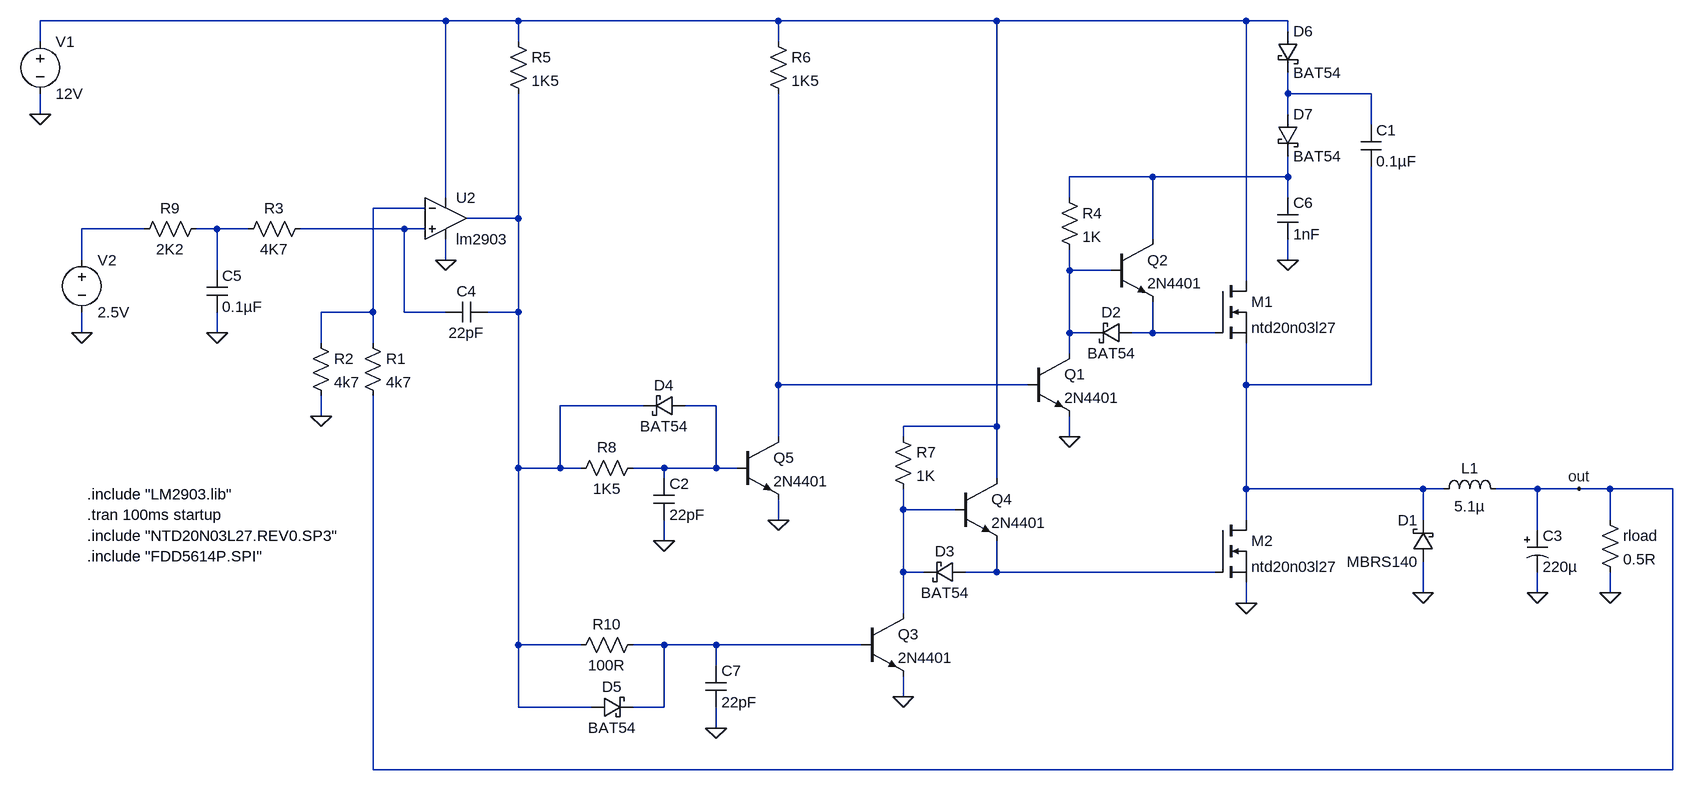
[diagram p0: schematic discrete buck - 10A.asc]
discrete buck - 10A.asc, the LTspice schematic file:
Version 4
SHEET 1 1956 1540
WIRE -288 96 -912 96
WIRE -176 96 -288 96
WIRE 224 96 -176 96
WIRE 560 96 224 96
WIRE 944 96 560 96
WIRE 1008 96 944 96
WIRE 1008 112 1008 96
WIRE -912 128 -912 96
WIRE -176 128 -176 96
WIRE 224 128 224 96
WIRE 1008 208 1008 176
WIRE 1136 208 1008 208
WIRE -912 240 -912 208
WIRE 1008 240 1008 208
WIRE 1136 256 1136 208
WIRE 800 336 672 336
WIRE 1008 336 1008 304
WIRE 1008 336 800 336
WIRE -288 368 -288 96
WIRE 672 368 672 336
WIRE 1008 368 1008 336
WIRE -320 384 -400 384
WIRE -176 400 -176 208
WIRE -176 400 -256 400
WIRE -752 416 -848 416
WIRE -640 416 -672 416
WIRE -592 416 -640 416
WIRE -352 416 -512 416
WIRE -320 416 -352 416
WIRE 800 432 800 336
WIRE -848 464 -848 416
WIRE -288 464 -288 432
WIRE 1008 464 1008 432
WIRE -640 480 -640 416
WIRE 672 480 672 448
WIRE 736 480 672 480
WIRE 944 496 944 96
WIRE -400 544 -400 384
WIRE -400 544 -480 544
WIRE -352 544 -352 416
WIRE -288 544 -352 544
WIRE -176 544 -176 400
WIRE -176 544 -224 544
WIRE -848 576 -848 544
WIRE -640 576 -640 544
WIRE 672 576 672 480
WIRE 704 576 672 576
WIRE 800 576 800 528
WIRE 800 576 768 576
WIRE 896 576 800 576
WIRE -480 592 -480 544
WIRE -400 592 -400 544
WIRE 672 608 672 576
WIRE 224 656 224 208
WIRE 608 656 224 656
WIRE 944 656 944 592
WIRE 1136 656 1136 320
WIRE 1136 656 944 656
WIRE 16 688 -112 688
WIRE 128 688 80 688
WIRE -480 704 -480 672
WIRE 560 720 560 96
WIRE 560 720 416 720
WIRE 224 736 224 656
WIRE 416 736 416 720
WIRE 672 736 672 704
WIRE -176 784 -176 544
WIRE -112 784 -112 688
WIRE -112 784 -176 784
WIRE -80 784 -112 784
WIRE 48 784 0 784
WIRE 128 784 128 688
WIRE 128 784 48 784
WIRE 160 784 128 784
WIRE 48 800 48 784
WIRE 560 800 560 720
WIRE 944 816 944 656
WIRE 1216 816 944 816
WIRE 1248 816 1216 816
WIRE 1392 816 1328 816
WIRE 1456 816 1392 816
WIRE 1504 816 1456 816
WIRE 1600 816 1504 816
WIRE 416 848 416 816
WIRE 496 848 416 848
WIRE 224 864 224 832
WIRE 944 864 944 816
WIRE 1216 864 1216 816
WIRE 1504 864 1504 816
WIRE 1392 880 1392 816
WIRE 48 896 48 864
WIRE 416 944 416 848
WIRE 448 944 416 944
WIRE 560 944 560 896
WIRE 560 944 512 944
WIRE 896 944 560 944
WIRE 1216 976 1216 928
WIRE 1392 976 1392 944
WIRE 1504 976 1504 944
WIRE 944 992 944 960
WIRE 416 1008 416 944
WIRE -176 1056 -176 784
WIRE -80 1056 -176 1056
WIRE 48 1056 0 1056
WIRE 128 1056 48 1056
WIRE 352 1056 128 1056
WIRE 128 1088 128 1056
WIRE 416 1136 416 1104
WIRE -176 1152 -176 1056
WIRE -64 1152 -176 1152
WIRE 48 1152 48 1056
WIRE 48 1152 0 1152
WIRE 128 1184 128 1152
WIRE -400 1248 -400 672
WIRE 1600 1248 1600 816
WIRE 1600 1248 -400 1248
FLAG -912 240 0
FLAG -288 464 0
FLAG 1392 976 0
FLAG 1504 976 0
FLAG -640 576 0
FLAG 1216 976 0
FLAG 1456 816 out
FLAG -848 576 0
FLAG -480 704 0
FLAG 944 992 0
FLAG 416 1136 0
FLAG 672 736 0
FLAG 48 896 0
FLAG 1008 464 0
FLAG 224 864 0
FLAG 128 1184 0
SYMBOL voltage -912 112 R0
WINDOW 123 0 0 Left 2
WINDOW 39 0 0 Left 2
SYMATTR InstName V1
SYMATTR Value 12V
SYMBOL Opamps\\opamp2 -288 336 R0
SYMATTR InstName U2
SYMATTR Value lm2903
SYMBOL schottky 1232 928 R180
WINDOW 0 24 64 Left 2
WINDOW 3 24 0 Left 2
SYMATTR InstName D1
SYMATTR Value MBRS140
SYMATTR Description Diode
SYMATTR Type diode
SYMBOL polcap 1376 880 R0
WINDOW 3 24 56 Left 2
SYMATTR Value 220µ
SYMATTR InstName C3
SYMATTR Description Capacitor
SYMATTR Type cap
SYMATTR SpiceLine V=10 Irms=1.535 Rser=0.07 Lser=0 mfg="KEMET" pn="T495X227K010AS4823" type="Tantalum"
SYMBOL ind 1232 832 R270
WINDOW 0 32 56 VTop 2
WINDOW 3 5 56 VBottom 2
SYMATTR InstName L1
SYMATTR Value 5.1µ
SYMATTR SpiceLine Ipk=11.2 Rser=0.0057 Rpar=1000k Cpar=0
SYMBOL schottky 768 560 R90
WINDOW 0 0 32 VBottom 2
WINDOW 3 32 32 VTop 2
SYMATTR InstName D2
SYMATTR Value BAT54
SYMATTR Description Diode
SYMATTR Type diode
SYMBOL res 656 352 R0
SYMATTR InstName R4
SYMATTR Value 1K
SYMBOL res -192 112 R0
SYMATTR InstName R5
SYMATTR Value 1K5
SYMBOL cap -224 528 R90
WINDOW 0 0 32 VBottom 2
WINDOW 3 32 32 VTop 2
SYMATTR InstName C4
SYMATTR Value 22pF
SYMBOL res -656 400 R90
WINDOW 0 0 56 VBottom 2
WINDOW 3 32 56 VTop 2
SYMATTR InstName R9
SYMATTR Value 2K2
SYMBOL cap -656 480 R0
SYMATTR InstName C5
SYMATTR Value 0.1µF
SYMBOL res 1488 848 R0
SYMATTR InstName rload
SYMATTR Value 0.5R
SYMBOL nmos 896 864 R0
SYMATTR InstName M2
SYMATTR Value ntd20n03l27
SYMATTR Prefix X
SYMBOL voltage -848 448 R0
WINDOW 123 0 0 Left 2
WINDOW 39 0 0 Left 2
SYMATTR InstName V2
SYMATTR Value 2.5V
SYMBOL res -416 576 R0
SYMATTR InstName R1
SYMATTR Value 4k7
SYMBOL res -496 576 R0
SYMATTR InstName R2
SYMATTR Value 4k7
SYMBOL npn3 736 432 R0
SYMATTR InstName Q2
SYMATTR Value 2N4401
SYMBOL res -496 400 R90
WINDOW 0 0 56 VBottom 2
WINDOW 3 32 56 VTop 2
SYMATTR InstName R3
SYMATTR Value 4K7
SYMBOL res 400 720 R0
SYMATTR InstName R7
SYMATTR Value 1K
SYMBOL npn3 496 800 R0
SYMATTR InstName Q4
SYMATTR Value 2N4401
SYMBOL schottky 512 928 R90
WINDOW 0 0 32 VBottom 2
WINDOW 3 32 32 VTop 2
SYMATTR InstName D3
SYMATTR Value BAT54
SYMATTR Description Diode
SYMATTR Type diode
SYMBOL npn3 352 1008 R0
SYMATTR InstName Q3
SYMATTR Value 2N4401
SYMBOL res 16 1040 R90
WINDOW 0 0 56 VBottom 2
WINDOW 3 32 56 VTop 2
SYMATTR InstName R10
SYMATTR Value 100R
SYMBOL npn3 608 608 R0
SYMATTR InstName Q1
SYMATTR Value 2N4401
SYMBOL res 16 768 R90
WINDOW 0 0 56 VBottom 2
WINDOW 3 32 56 VTop 2
SYMATTR InstName R8
SYMATTR Value 1K5
SYMBOL schottky 80 672 R90
WINDOW 0 0 32 VBottom 2
WINDOW 3 32 32 VTop 2
SYMATTR InstName D4
SYMATTR Value BAT54
SYMATTR Description Diode
SYMATTR Type diode
SYMBOL cap 32 800 R0
SYMATTR InstName C2
SYMATTR Value 22pF
SYMBOL schottky -64 1168 R270
WINDOW 0 32 32 VTop 2
WINDOW 3 0 32 VBottom 2
SYMATTR InstName D5
SYMATTR Value BAT54
SYMATTR Description Diode
SYMATTR Type diode
SYMBOL nmos 896 496 R0
SYMATTR InstName M1
SYMATTR Value ntd20n03l27
SYMATTR Prefix X
SYMBOL schottky 992 112 R0
SYMATTR InstName D6
SYMATTR Value BAT54
SYMATTR Description Diode
SYMATTR Type diode
SYMBOL schottky 992 240 R0
SYMATTR InstName D7
SYMATTR Value BAT54
SYMATTR Description Diode
SYMATTR Type diode
SYMBOL cap 992 368 R0
SYMATTR InstName C6
SYMATTR Value 1nF
SYMBOL cap 1120 256 R0
SYMATTR InstName C1
SYMATTR Value 0.1µF
SYMBOL res 208 112 R0
SYMATTR InstName R6
SYMATTR Value 1K5
SYMBOL cap 112 1088 R0
SYMATTR InstName C7
SYMATTR Value 22pF
SYMBOL npn3 160 736 R0
SYMATTR InstName Q5
SYMATTR Value 2N4401
TEXT -840 856 Left 2 !.tran 100ms startup
TEXT -840 888 Left 2 !.include "NTD20N03L27.REV0.SP3"
TEXT -840 824 Left 2 !.include "LM2903.lib"
TEXT -840 920 Left 2 !.include "FDD5614P.SPI"

The netlist it stands for:
* discrete buck - 10A.asc
V1 N001 0 12V
XU2 N008 N004 N001 0 N005 lm2903  ; pins In+ In- V+ V- OUT
D1 0 N012 MBRS140
C3 out 0 220µ V=10 Irms=1.535 Rser=0.07 Lser=0 mfg="KEMET" pn="T495X227K010AS4823" type="Tantalum"
L1 N012 out 5.1µ Ipk=11.2 Rser=0.0057 Rpar=1000k Cpar=0
D2 N010 N009 BAT54
R4 N003 N009 1K
R5 N001 N005 1K5
C4 N005 N008 22pF
R9 N007 N006 2K2
C5 N007 0 0.1µF
rload out 0 0.5R
XM2 N012 N015 0 ntd20n03l27  ; pins D G S
V2 N006 0 2.5V
R1 N004 out 4k7
R2 N004 0 4k7
Q2 N003 N009 N010 0 2N4401
R3 N008 N007 4K7
R7 N001 N014 1K
Q4 N001 N014 N015 0 2N4401
D3 N015 N014 BAT54
Q3 N014 N016 0 0 2N4401
R10 N016 N005 100R
Q1 N009 N011 0 0 2N4401
R8 N013 N005 1K5
D4 N013 N005 BAT54
C2 N013 0 22pF
D5 N005 N016 BAT54
XM1 N001 N010 N012 ntd20n03l27  ; pins D G S
D6 N001 N002 BAT54
D7 N002 N003 BAT54
C6 N003 0 1nF
C1 N002 N012 0.1µF
R6 N001 N011 1K5
C7 N016 0 22pF
Q5 N011 N013 0 0 2N4401
.model D D
.lib standard.dio
.model NPN NPN
.model PNP PNP
.lib standard.bjt
.tran 100ms startup
.include "NTD20N03L27.REV0.SP3"
.include "LM2903.lib"
.include "FDD5614P.SPI"
.backanno
.end